# Altium project BUOI13.PrjPcb
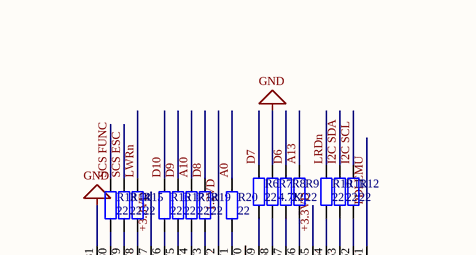
[diagram p0: BUOI13.SchDoc, top left]
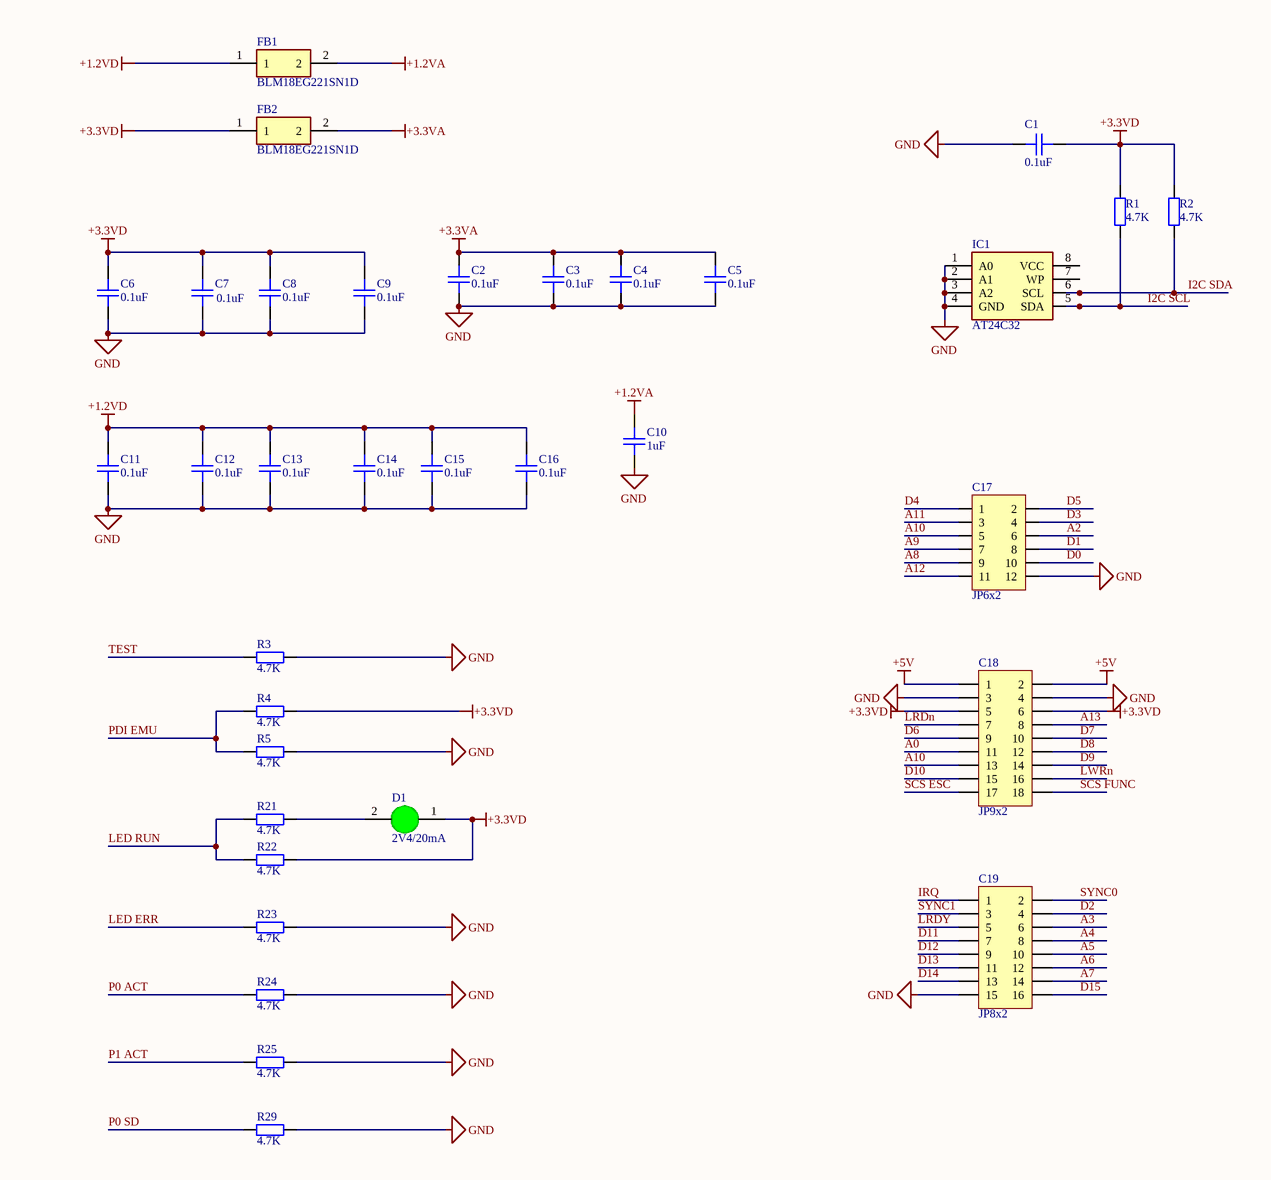
[diagram p1: BUOI13.SchDoc, top right]
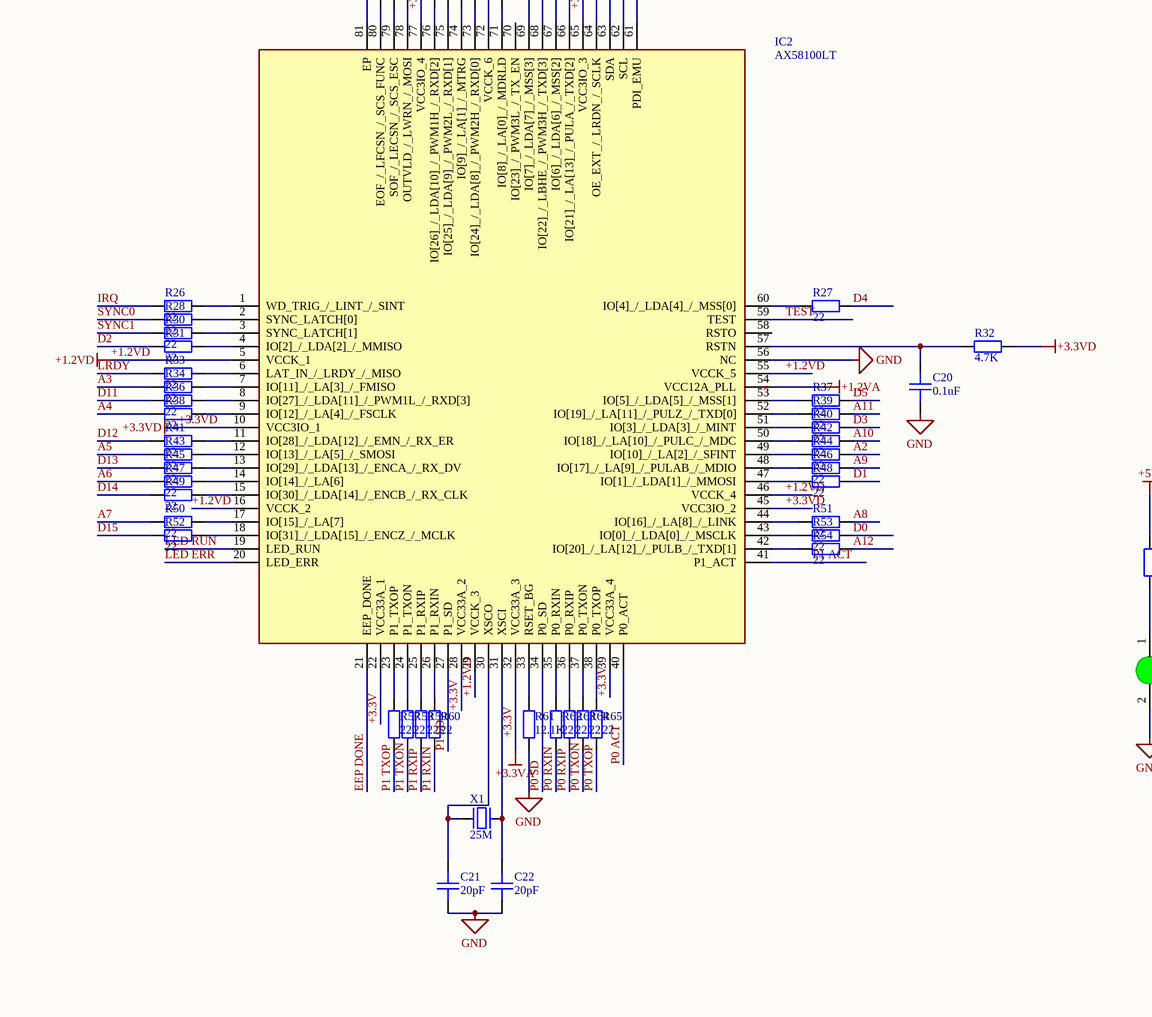
[diagram p2: BUOI13.SchDoc, bottom left]
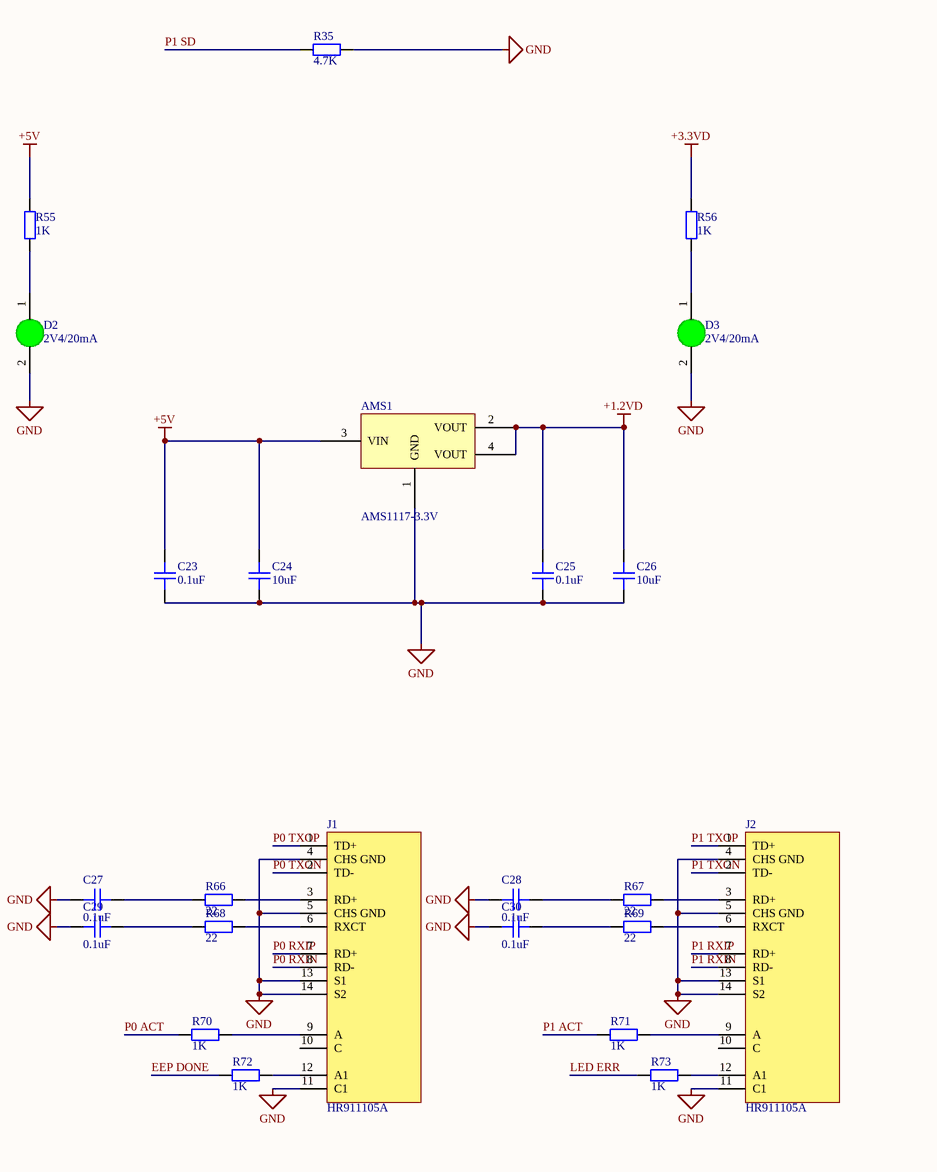
[diagram p3: BUOI13.SchDoc, bottom right]
1 sheet, 114 parts. Net scope: global (net labels, ports and power ports of the same name join across sheets).
Board file: BUOI13.PcbDoc

## Sheet BUOI13.SchDoc
size D

### Parts
AMS1  AMS1117-3.3V  [SOT223-4N]
C1  0.1uF  [CAPC-0603 (1608)]
C2  0.1uF  [CAPC-0603 (1608)]
C3  0.1uF  [CAPC-0603 (1608)]
C4  0.1uF  [CAPC-0603 (1608)]
C5  0.1uF  [CAPC-0603 (1608)]
C6  0.1uF  [CAPC-0603 (1608)]
C7  0.1uF  [CAPC-0603 (1608)]
C8  0.1uF  [CAPC-0603 (1608)]
C9  0.1uF  [CAPC-0603 (1608)]
C10  1uF  [CAPC-0603 (1608)]
C11  0.1uF  [CAPC-0603 (1608)]
C12  0.1uF  [CAPC-0603 (1608)]
C13  0.1uF  [CAPC-0603 (1608)]
C14  0.1uF  [CAPC-0603 (1608)]
C15  0.1uF  [CAPC-0603 (1608)]
C16  0.1uF  [CAPC-0603 (1608)]
C17  JP6x2  [JP6-D2T]
C18  JP9x2  [JP9-D2T]
C19  JP8x2  [JP8-D2T]
C20  0.1uF  [CAPC-0603 (1608)]
C21  20pF  [CAPC-0603 (1608)]
C22  20pF  [CAPC-0603 (1608)]
C23  0.1uF  [CAPC-0603 (1608)]
C24  10uF  [CAPC-0603 (1608)]
C25  0.1uF  [CAPC-0603 (1608)]
C26  10uF  [CAPC-0603 (1608)]
C27  0.1uF  [CAPC-0603 (1608)]
C28  0.1uF  [CAPC-0603 (1608)]
C29  0.1uF  [CAPC-0603 (1608)]
C30  0.1uF  [CAPC-0603 (1608)]
D1  2V4/20mA  [LED_0805_GREEN]
D2  2V4/20mA  [LED_0805_GREEN]
D3  2V4/20mA  [LED_0805_GREEN]
FB1  BLM18EG221SN1D  [BLM18EG121SH1D]
FB2  BLM18EG221SN1D  [BLM18EG121SH1D]
IC1  AT24C32  [SOIC127P600X175-8N]
IC2  AX58100LT  [QFP40P1200X1200X160-81N]
J1  HR911105A  [HR911105A]
J2  HR911105A  [HR911105A]
R1  4.7K  [RESC-0603 (1608)]
R2  4.7K  [RESC-0603 (1608)]
R3  4.7K  [RESC-0603 (1608)]
R4  4.7K  [RESC-0603 (1608)]
R5  4.7K  [RESC-0603 (1608)]
R6  22  [RESC-0603 (1608)]
R7  4.7K  [RESC-0603 (1608)]
R8  22  [RESC-0603 (1608)]
R9  22  [RESC-0603 (1608)]
R10  22  [RESC-0603 (1608)]
R11  22  [RESC-0603 (1608)]
R12  22  [RESC-0603 (1608)]
R13  22  [RESC-0603 (1608)]
R14  22  [RESC-0603 (1608)]
R15  22  [RESC-0603 (1608)]
R16  22  [RESC-0603 (1608)]
R17  22  [RESC-0603 (1608)]
R18  22  [RESC-0603 (1608)]
R19  22  [RESC-0603 (1608)]
R20  22  [RESC-0603 (1608)]
R21  4.7K  [RESC-0603 (1608)]
R22  4.7K  [RESC-0603 (1608)]
R23  4.7K  [RESC-0603 (1608)]
R24  4.7K  [RESC-0603 (1608)]
R25  4.7K  [RESC-0603 (1608)]
R26  22  [RESC-0603 (1608)]
R27  22  [RESC-0603 (1608)]
R28  22  [RESC-0603 (1608)]
R29  4.7K  [RESC-0603 (1608)]
R30  22  [RESC-0603 (1608)]
R31  22  [RESC-0603 (1608)]
R32  4.7K  [RESC-0603 (1608)]
R33  22  [RESC-0603 (1608)]
R34  22  [RESC-0603 (1608)]
R35  4.7K  [RESC-0603 (1608)]
R36  22  [RESC-0603 (1608)]
R37  22  [RESC-0603 (1608)]
R38  22  [RESC-0603 (1608)]
R39  22  [RESC-0603 (1608)]
R40  22  [RESC-0603 (1608)]
R41  22  [RESC-0603 (1608)]
R42  22  [RESC-0603 (1608)]
R43  22  [RESC-0603 (1608)]
R44  22  [RESC-0603 (1608)]
R45  22  [RESC-0603 (1608)]
R46  22  [RESC-0603 (1608)]
R47  22  [RESC-0603 (1608)]
R48  22  [RESC-0603 (1608)]
R49  22  [RESC-0603 (1608)]
R50  22  [RESC-0603 (1608)]
R51  22  [RESC-0603 (1608)]
R52  22  [RESC-0603 (1608)]
R53  22  [RESC-0603 (1608)]
R54  22  [RESC-0603 (1608)]
R55  1K  [RESC-0603 (1608)]
R56  1K  [RESC-0603 (1608)]
R57  22  [RESC-0603 (1608)]
R58  22  [RESC-0603 (1608)]
R59  22  [RESC-0603 (1608)]
R60  22  [RESC-0603 (1608)]
R61  12.1K  [RESC-0603 (1608)]
R62  22  [RESC-0603 (1608)]
R63  22  [RESC-0603 (1608)]
R64  22  [RESC-0603 (1608)]
R65  22  [RESC-0603 (1608)]
R66  22  [RESC-0603 (1608)]
R67  22  [RESC-0603 (1608)]
R68  22  [RESC-0603 (1608)]
R69  22  [RESC-0603 (1608)]
R70  1K  [RESC-0603 (1608)]
R71  1K  [RESC-0603 (1608)]
R72  1K  [RESC-0603 (1608)]
R73  1K  [RESC-0603 (1608)]
X1  25M  [XTAL-RU49/4]

### Nets
+1.2VA: C10.2 FB1.2 IC2.54(VCC12A_PLL)
+1.2VD: AMS1.2(VOUT) AMS1.4(VOUT) C11.2 C12.2 C13.2 C14.2 C15.2 C16.2 C25.2 C26.2 FB1.1 IC2.5(VCCK_1) IC2.16(VCCK_2) IC2.29(VCCK_3) IC2.46(VCCK_4) IC2.55(VCCK_5) IC2.72(VCCK_6)
+3.3V: C2.2 C3.2 C4.2 C5.2 FB2.2 IC2.22(VCC33A_1) IC2.28(VCC33A_2) IC2.32(VCC33A_3) IC2.39(VCC33A_4)  [also labelled +3.3VA]
+3.3VD: C1.1 C6.2 C7.2 C8.2 C9.2 C18.3(5) C18.16(6) D1.1(A) FB2.1 IC2.10(VCC3IO_1) IC2.45(VCC3IO_2) IC2.65(VCC3IO_3) IC2.77(VCC3IO_4) R1.2 R2.2 R4.1 R22.1 R32.2 R56.2
+5V: AMS1.3(VIN) C18.1 C18.18(2) C23.2 C24.2 R55.2
GND: AMS1.1(GND) C1.2 C2.1 C3.1 C4.1 C5.1 C6.1 C7.1 C8.1 C9.1 C10.1 C11.1 C12.1 C13.1 C14.1 C15.1 C16.1 C17.7(12) C18.2(3) C18.17(4) C19.8(15) C20.1 C21.1 C22.1 C23.1 C24.1 C25.1 C26.1 C27.2 C28.2 C29.2 C30.2 D2.2(K) D3.2(K) IC1.1(A0) IC1.2(A1) IC1.3(A2) IC1.4(GND) IC2.56(NC) IC2.81(EP) J1.4(CHS_GND) J1.5(CHS_GND) J1.11(C1) J1.13(S1) J1.14(S2) J2.4(CHS_GND) J2.5(CHS_GND) J2.11(C1) J2.13(S1) J2.14(S2) R3.1 R5.1 R7.2 R23.1 R24.1 R25.1 R29.1 R35.1 R61.2
A0: C18.6(11) R20.2
A2: C17.10(6) R44.2
A3: C19.14(6) R34.1
A4: C19.13(8) R38.1
A5: C19.12(10) R43.1
A6: C19.11(12) R47.1
A7: C19.10(14) R50.1
A8: C17.5(9) R51.2
A9: C17.4(7) R46.2
A10: C17.3(5) C18.7(13) R18.2 R42.2
A11: C17.2(3) R39.2
A12: C17.6(11) R54.2
A13: C18.15(8) R9.1
D0: C17.8(10) R53.2
D1: C17.9(8) R48.2
D2: C19.15(4) R31.1
D3: C17.11(4) R40.2
D4: C17.1 R27.2
D5: C17.12(2) R37.2
D6: C18.5(9) R8.2
D7: C18.14(10) R6.2
D8: C18.13(12) R19.1
D9: C18.12(14) R17.1
D10: C18.8(15) R16.1
D11: C19.4(7) R36.1
D12: C19.5(9) R41.1
D13: C19.6(11) R45.1
D14: C19.7(13) R49.1
D15: C19.9(16) R52.1
EEP DONE: IC2.21(EEP_DONE) R72.1
I2C SCL: IC1.5(SDA) R1.1 R12.1
I2C SDA: IC1.6(SCL) R2.1 R11.1
IRQ: C19.1 R26.1
LED ERR: IC2.20(LED_ERR) R23.2 R73.1
LED RUN: IC2.19(LED_RUN) R21.2 R22.2
LRDn: C18.4(7) R10.1
LRDY: C19.3(5) R33.1
LWRn: C18.11(16) R15.1
P0 ACT: IC2.40(P0_ACT) R24.2 R70.1
P0 RXIN: J1.8(RD-) R62.2
P0 RXIP: J1.7(RD+) R63.2
P0 SD: IC2.34(P0_SD) R29.2
P0 TXON: J1.2(TD-) R64.2
P0 TXOP: J1.1(TD+) R65.2
P1 ACT: IC2.41(P1_ACT) R25.2 R71.1
P1 RXIN: J2.8(RD-) R60.2
P1 RXIP: J2.7(RD+) R59.2
P1 SD: IC2.27(P1_SD) R35.2
P1 TXON: J2.2(TD-) R58.2
P1 TXOP: J2.1(TD+) R57.2
PDI EMU: IC2.61(PDI_EMU) R4.2 R5.2
SCS ESC: C18.9(17) R14.1
SCS FUNC: C18.10(18) R13.1
SYNC0: C19.16(2) R28.1
SYNC1: C19.2(3) R30.1
TEST: IC2.59(TEST) R3.2
NetC20_2: C20.2 IC2.57(RSTN) R32.1
NetC21_2: C21.2 IC2.30(XSCO) X1.2
NetC22_2: C22.2 IC2.31(XSCI) X1.1
NetC27_1: C27.1 R66.1
NetC28_1: C28.1 R67.1
NetC29_1: C29.1 R68.1
NetC30_1: C30.1 R69.1
NetD1_2: D1.2(K) R21.1
NetD2_1: D2.1(A) R55.1
NetD3_1: D3.1(A) R56.1
NetIC2_1: IC2.1(WD_TRIG_/_LINT_/_SINT) R26.2
NetIC2_2: IC2.2(SYNC_LATCH[0]) R28.2
NetIC2_3: IC2.3(SYNC_LATCH[1]) R30.2
NetIC2_4: IC2.4(IO[2]_/_LDA[2]_/_MMISO) R31.2
NetIC2_6: IC2.6(LAT_IN_/_LRDY_/_MISO) R33.2
NetIC2_7: IC2.7(IO[11]_/_LA[3]_/_FMISO) R34.2
NetIC2_8: IC2.8(IO[27]_/_LDA[11]_/_PWM1L_/_RXD[3]) R36.2
NetIC2_9: IC2.9(IO[12]_/_LA[4]_/_FSCLK) R38.2
NetIC2_11: IC2.11(IO[28]_/_LDA[12]_/_EMN_/_RX_ER) R41.2
NetIC2_12: IC2.12(IO[13]_/_LA[5]_/_SMOSI) R43.2
NetIC2_13: IC2.13(IO[29]_/_LDA[13]_/_ENCA_/_RX_DV) R45.2
NetIC2_14: IC2.14(IO[14]_/_LA[6]) R47.2
NetIC2_15: IC2.15(IO[30]_/_LDA[14]_/_ENCB_/_RX_CLK) R49.2
NetIC2_17: IC2.17(IO[15]_/_LA[7]) R50.2
NetIC2_18: IC2.18(IO[31]_/_LDA[15]_/_ENCZ_/_MCLK) R52.2
NetIC2_23: IC2.23(P1_TXOP) R57.1
NetIC2_24: IC2.24(P1_TXON) R58.1
NetIC2_25: IC2.25(P1_RXIP) R59.1
NetIC2_26: IC2.26(P1_RXIN) R60.1
NetIC2_33: IC2.33(RSET_BG) R61.1
NetIC2_35: IC2.35(P0_RXIN) R62.1
NetIC2_36: IC2.36(P0_RXIP) R63.1
NetIC2_37: IC2.37(P0_TXON) R64.1
NetIC2_38: IC2.38(P0_TXOP) R65.1
NetIC2_42: IC2.42(IO[20]_/_LA[12]_/_PULB_/_TXD[1]) R54.1
NetIC2_43: IC2.43(IO[0]_/_LDA[0]_/_MSCLK) R53.1
NetIC2_44: IC2.44(IO[16]_/_LA[8]_/_LINK) R51.1
NetIC2_47: IC2.47(IO[1]_/_LDA[1]_/_MMOSI) R48.1
NetIC2_48: IC2.48(IO[17]_/_LA[9]_/_PULAB_/_MDIO) R46.1
NetIC2_49: IC2.49(IO[10]_/_LA[2]_/_SFINT) R44.1
NetIC2_50: IC2.50(IO[18]_/_LA[10]_/_PULC_/_MDC) R42.1
NetIC2_51: IC2.51(IO[3]_/_LDA[3]_/_MINT) R40.1
NetIC2_52: IC2.52(IO[19]_/_LA[11]_/_PULZ_/_TXD[0]) R39.1
NetIC2_53: IC2.53(IO[5]_/_LDA[5]_/_MSS[1]) R37.1
NetIC2_60: IC2.60(IO[4]_/_LDA[4]_/_MSS[0]) R27.1
NetIC2_62: IC2.62(SCL) R12.2
NetIC2_63: IC2.63(SDA) R11.2
NetIC2_64: IC2.64(OE_EXT_/_LRDN_/_SCLK) R10.2
NetIC2_66: IC2.66(IO[21]_/_LA[13]_/_PULA_/_TXD[2]) R9.2
NetIC2_67: IC2.67(IO[6]_/_LDA[6]_/_MSS[2]) R8.1
NetIC2_68: IC2.68(IO[22]_/_LBHE_/_PWM3H_/_TXD[3]) R7.1
NetIC2_69: IC2.69(IO[7]_/_LDA[7]_/_MSS[3]) R6.1
NetIC2_71: IC2.71(IO[8]_/_LA[0]_/_MDRLD) R20.1
NetIC2_73: IC2.73(IO[24]_/_LDA[8]_/_PWM2H_/_RXD[0]) R19.2
NetIC2_74: IC2.74(IO[9]_/_LA[1]_/_MTRG) R18.1
NetIC2_75: IC2.75(IO[25]_/_LDA[9]_/_PWM2L_/_RXD[1]) R17.2
NetIC2_76: IC2.76(IO[26]_/_LDA[10]_/_PWM1H_/_RXD[2]) R16.2
NetIC2_78: IC2.78(OUTVLD_/_LWRN_/_MOSI) R15.2
NetIC2_79: IC2.79(SOF_/_LECSN_/_SCS_ESC) R14.2
NetIC2_80: IC2.80(EOF_/_LFCSN_/_SCS_FUNC) R13.2
NetJ1_3: J1.3(RD+) R66.2
NetJ1_6: J1.6(RXCT) R68.2
NetJ1_9: J1.9(A) R70.2
NetJ1_12: J1.12(A1) R72.2
NetJ2_3: J2.3(RD+) R67.2
NetJ2_6: J2.6(RXCT) R69.2
NetJ2_9: J2.9(A) R71.2
NetJ2_12: J2.12(A1) R73.2

Not connected (* = marked no-connect by the designer): IC1 7(WP) 8(VCC); IC2 58(RSTO) 70(IO[23]_/_PWM3L_/_TX_EN); J1 10(C); J2 10(C)

### Library data of the parts
AMS1 = AMS1117: Dán; Value: AMS1117-3.3V SOT223; Don_Vi: Con; Ma_Hang: MH000596; Ghi_Chu: *; Kieu_Chan: *; Chung_Loai: Dán
C1-C16 C20-C30 = 0603N330J500CT: CAP CER 33pF 50V 5%  0603; MPN: CL10C330JB8NNNC, 0603N330J500CT; CompanyID: VT-01106; Solder: SMT; Value: 33p/50V; Category: CAPACITOR; PinCount: 2
C17 = JP6x2: WR-PHD 2.54 mm Dual Socket Header; Manufacturer: W¨¹rth Elektronik eiSos GmbH; partNo: 61301221821; ComponentLink1 Description: Manufacturer; ComponentLink2 Description: Datasheet; NoPins: 12; Created Date: 29 March 2013; ComponentLink1URL: http://www.we-online.com; ComponentLink2URL: http://katalog.we-online.de/em/datasheet/6130xx21821.pdf; Created by: Karrer Zheng
C18 = JP9x2: WR-PHD 2.54 mm Dual Socket Header; Manufacturer: W¨¹rth Elektronik eiSos GmbH; partNo: 61301821821; ComponentLink1 Description: Manufacturer; ComponentLink2 Description: Datasheet; NoPins: 18; Created Date: 29 March 2013; ComponentLink1URL: http://www.we-online.com; ComponentLink2URL: http://katalog.we-online.de/em/datasheet/6130xx21821.pdf; Created by: Karrer Zheng
C19 = JP8x2: WR-PHD 2.54 mm Dual Socket Header; Manufacturer: W¨¹rth Elektronik eiSos GmbH; partNo: 61301621821; ComponentLink1 Description: Manufacturer; ComponentLink2 Description: Datasheet; NoPins: 16; Created Date: 29 March 2013; ComponentLink1URL: http://www.we-online.com; ComponentLink2URL: http://katalog.we-online.de/em/datasheet/6130xx21821.pdf; Created by: Karrer Zheng
D1-D3 = 17-21/G6C-FM1N2B/3T: LED GREEN CLEAR 2V4 20mA 0805 SMD; CompanyID: VT-00393; Solder: SMT; MPN: 17-21/G6C-FM1N2B/3T; Value: 2V4/20mA
FB1 FB2 = BLM18EG221SN1D: Ferrite Bead; Manufacturer_Name: Murata Electronics; Datasheet Link: http://www.murata.com/~/media/webrenewal/support/library/catalog/products/emc/emifil/c31e.ashx?la=en-gb; Height: 0.95mm; Manufacturer_Part_Number: BLM18EG221SN1D; Mouser Part Number: 81-BLM18EG221SN1D; Mouser Price/Stock: https://www.mouser.co.uk/ProductDetail/Murata-Electronics/BLM18EG221SN1D?qs=uSeJpk%2F8In2DDeSj2a4KGA%3D%3D; Arrow Part Number: BLM18EG221SN1D; Arrow Price/Stock: https://www.arrow.com/en/products/blm18eg221sn1d/murata-manufacturing?region=europe
IC1 = AT24C32: Integrated Circuit; Manufacturer_Name: Microchip; Datasheet Link: https://ww1.microchip.com/downloads/en/DeviceDoc/doc0336.pdf; Height: 5.334mm; Manufacturer_Part_Number: AT24C32; Mouser Part Number: N/A; Mouser Price/Stock: https://www.mouser.co.uk/ProductDetail/Microchip-Technology-Atmel/AT24C32?qs=HbI%2FMOA3e15bWuuoyy2xIw%3D%3D
IC2 = AX58100LT: Integrated Circuit; Manufacturer_Name: ASIX; Datasheet Link: https://cdn.infinigo.com/pdf/8fbda183-acaa-42bd-9b7a-1a435fa63bee.pdf?t=1653368662&k=22be6ea2ab67c3bbe73e3c295d80e3b4; Height: 1.6mm; Manufacturer_Part_Number: AX58100LT
J1 J2 = HR911105A: Hanrun HR911105A RJ-45 Connector; Solder: WAVE; MPN: HR911105A; MFR: HanRun; Value: HR911105A
R1-R73 = AC0603FR-0713KL: RES SMD 13K OHM 1% 1/10W 0603; CompanyID: VT-00329; Solder: SMT; MPN: AC0603FR-0713KL; Value: 13K; Category: RESISTOR
X1 = XT2: Crystal, 32.768 KHz, -40 to 85 degC, 3.2 x 1.5 x 0.9 mm SMD; Value: 4Mhz